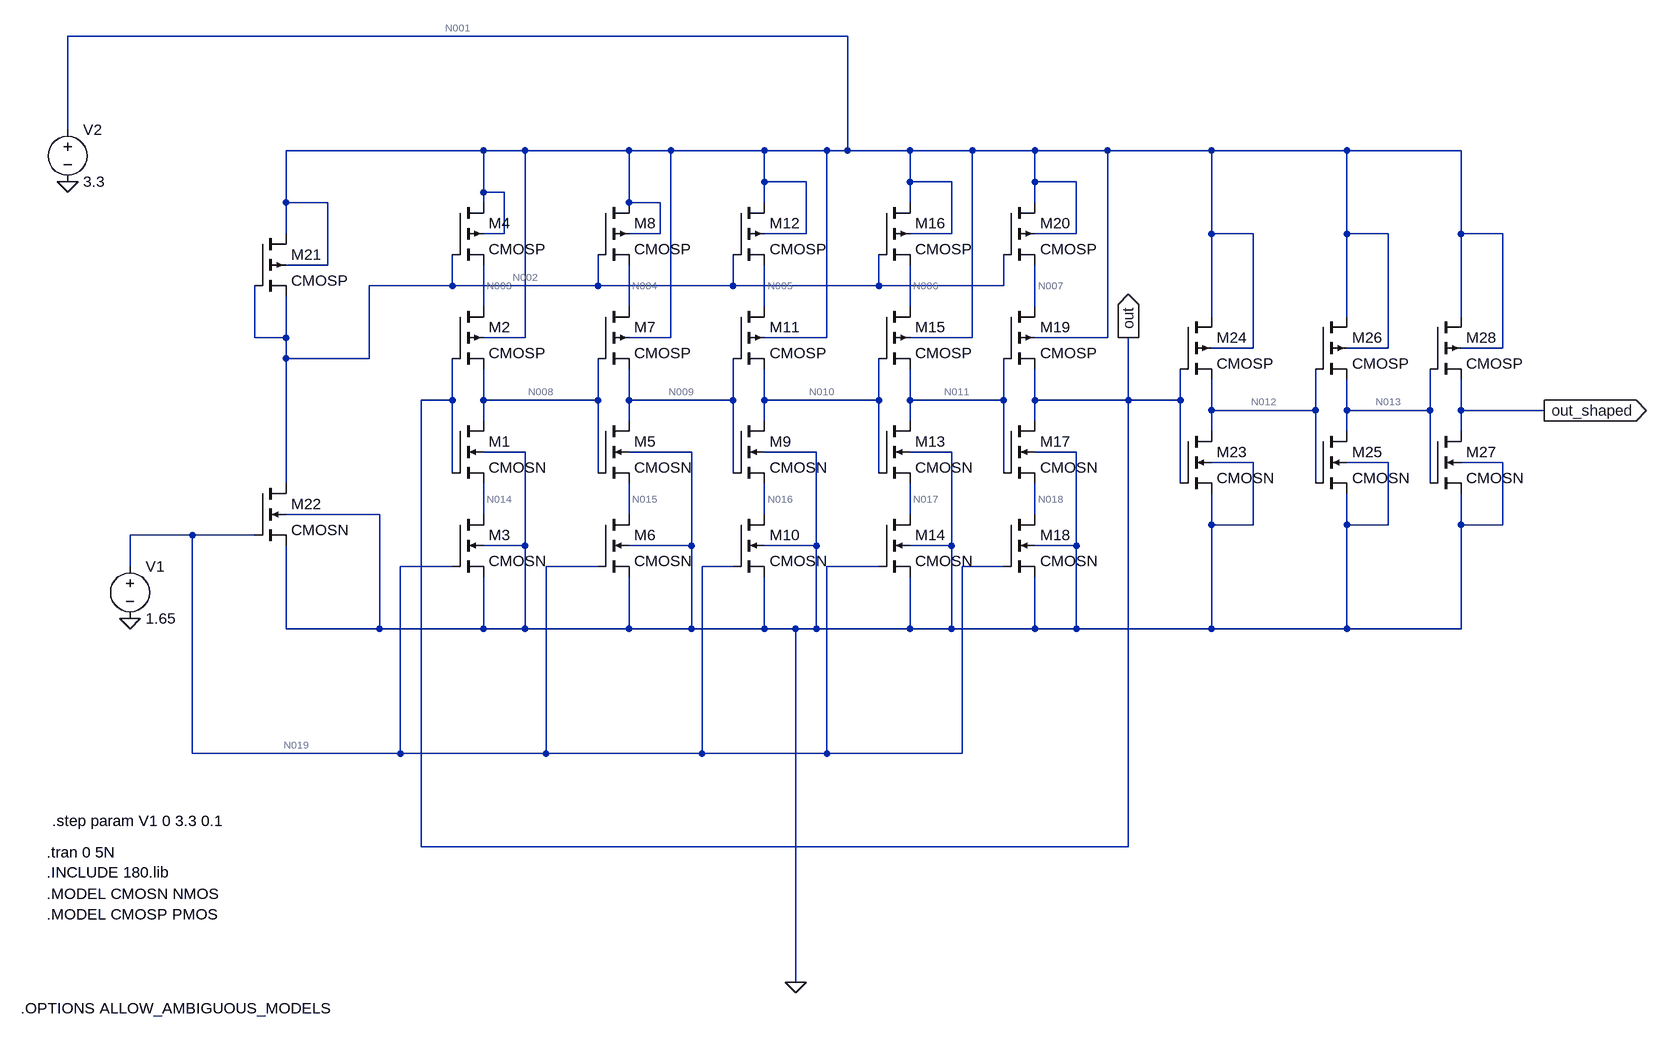
[diagram p0: schematic VCO.asc]
VCO.asc, the LTspice schematic file:
Version 4.1
SHEET 1 2180 1368
WIRE 688 -144 -512 -144
WIRE -512 0 -512 -144
WIRE 128 32 -176 32
WIRE 192 32 128 32
WIRE 352 32 192 32
WIRE 416 32 352 32
WIRE 560 32 416 32
WIRE 656 32 560 32
WIRE 688 32 688 -144
WIRE 688 32 656 32
WIRE 784 32 688 32
WIRE 880 32 784 32
WIRE 976 32 880 32
WIRE 1088 32 976 32
WIRE 1248 32 1088 32
WIRE 1456 32 1248 32
WIRE 1632 32 1456 32
WIRE 560 80 560 32
WIRE 624 80 560 80
WIRE 784 80 784 32
WIRE 848 80 784 80
WIRE 976 80 976 32
WIRE 1040 80 976 80
WIRE 128 96 128 32
WIRE 160 96 128 96
WIRE -176 112 -176 32
WIRE -112 112 -176 112
WIRE 128 112 128 96
WIRE 352 112 352 32
WIRE 400 112 352 112
WIRE 560 112 560 80
WIRE 784 112 784 80
WIRE 976 112 976 80
WIRE -176 160 -176 112
WIRE 160 160 160 96
WIRE 160 160 128 160
WIRE 400 160 400 112
WIRE 400 160 352 160
WIRE 624 160 624 80
WIRE 624 160 560 160
WIRE 848 160 848 80
WIRE 848 160 784 160
WIRE 1040 160 1040 80
WIRE 1040 160 976 160
WIRE 1248 160 1248 32
WIRE 1312 160 1248 160
WIRE 1456 160 1456 32
WIRE 1520 160 1456 160
WIRE 1632 160 1632 32
WIRE 1696 160 1632 160
WIRE -112 208 -112 112
WIRE -112 208 -176 208
WIRE 80 240 80 192
WIRE 80 240 -48 240
WIRE 304 240 304 192
WIRE 304 240 80 240
WIRE 512 240 512 192
WIRE 512 240 304 240
WIRE 736 240 736 192
WIRE 736 240 512 240
WIRE 928 240 928 192
WIRE 928 240 736 240
WIRE 128 272 128 208
WIRE 352 272 352 208
WIRE 560 272 560 208
WIRE 784 272 784 208
WIRE 976 272 976 208
WIRE 1248 288 1248 160
WIRE 1456 288 1456 160
WIRE 1632 288 1632 160
WIRE -224 320 -224 240
WIRE -176 320 -176 256
WIRE -176 320 -224 320
WIRE 192 320 192 32
WIRE 192 320 128 320
WIRE 416 320 416 32
WIRE 416 320 352 320
WIRE 656 320 656 32
WIRE 656 320 560 320
WIRE 880 320 880 32
WIRE 880 320 784 320
WIRE 1088 320 1088 32
WIRE 1088 320 976 320
WIRE 1312 336 1312 160
WIRE 1312 336 1248 336
WIRE 1520 336 1520 160
WIRE 1520 336 1456 336
WIRE 1696 336 1696 160
WIRE 1696 336 1632 336
WIRE -176 352 -176 320
WIRE -48 352 -48 240
WIRE -48 352 -176 352
WIRE 80 416 80 352
WIRE 80 416 32 416
WIRE 128 416 128 368
WIRE 304 416 304 352
WIRE 304 416 128 416
WIRE 352 416 352 368
WIRE 512 416 512 352
WIRE 512 416 352 416
WIRE 560 416 560 368
WIRE 736 416 736 352
WIRE 736 416 560 416
WIRE 784 416 784 368
WIRE 928 416 928 352
WIRE 928 416 784 416
WIRE 976 416 976 368
WIRE 1120 416 1120 320
WIRE 1120 416 976 416
WIRE 1200 416 1200 368
WIRE 1200 416 1120 416
WIRE 1248 432 1248 384
WIRE 1408 432 1408 368
WIRE 1408 432 1248 432
WIRE 1456 432 1456 384
WIRE 1584 432 1584 368
WIRE 1584 432 1456 432
WIRE 1632 432 1632 384
WIRE 1760 432 1632 432
WIRE 128 448 128 416
WIRE 352 448 352 416
WIRE 560 448 560 416
WIRE 784 448 784 416
WIRE 976 448 976 416
WIRE 1248 464 1248 432
WIRE 1456 464 1456 432
WIRE 1632 464 1632 432
WIRE 192 496 128 496
WIRE 448 496 352 496
WIRE 640 496 560 496
WIRE 848 496 784 496
WIRE 1040 496 976 496
WIRE 1312 512 1248 512
WIRE 1520 512 1456 512
WIRE 1696 512 1632 512
WIRE 80 528 80 416
WIRE 304 528 304 416
WIRE 512 528 512 416
WIRE 736 528 736 416
WIRE 928 528 928 416
WIRE -176 544 -176 352
WIRE 1200 544 1200 416
WIRE 1408 544 1408 432
WIRE 1584 544 1584 432
WIRE -32 592 -176 592
WIRE 128 592 128 544
WIRE 352 592 352 544
WIRE 560 592 560 544
WIRE 784 592 784 544
WIRE 976 592 976 544
WIRE 1248 608 1248 560
WIRE 1312 608 1312 512
WIRE 1312 608 1248 608
WIRE 1456 608 1456 560
WIRE 1520 608 1520 512
WIRE 1520 608 1456 608
WIRE 1632 608 1632 560
WIRE 1696 608 1696 512
WIRE 1696 608 1632 608
WIRE -320 624 -416 624
WIRE -224 624 -320 624
WIRE 192 640 192 496
WIRE 192 640 128 640
WIRE 448 640 448 496
WIRE 448 640 352 640
WIRE 640 640 640 496
WIRE 640 640 560 640
WIRE 848 640 848 496
WIRE 848 640 784 640
WIRE 1040 640 1040 496
WIRE 1040 640 976 640
WIRE -416 672 -416 624
WIRE 80 672 0 672
WIRE 304 672 224 672
WIRE 512 672 464 672
WIRE 736 672 656 672
WIRE 928 672 864 672
WIRE -176 768 -176 640
WIRE -32 768 -32 592
WIRE -32 768 -176 768
WIRE 128 768 128 688
WIRE 128 768 -32 768
WIRE 192 768 192 640
WIRE 192 768 128 768
WIRE 352 768 352 688
WIRE 352 768 192 768
WIRE 448 768 448 640
WIRE 448 768 352 768
WIRE 560 768 560 688
WIRE 560 768 448 768
WIRE 608 768 560 768
WIRE 640 768 640 640
WIRE 640 768 608 768
WIRE 784 768 784 688
WIRE 784 768 640 768
WIRE 848 768 848 640
WIRE 848 768 784 768
WIRE 976 768 976 688
WIRE 976 768 848 768
WIRE 1040 768 1040 640
WIRE 1040 768 976 768
WIRE 1248 768 1248 608
WIRE 1248 768 1040 768
WIRE 1456 768 1456 608
WIRE 1456 768 1248 768
WIRE 1632 768 1632 608
WIRE 1632 768 1456 768
WIRE -320 960 -320 624
WIRE 0 960 0 672
WIRE 0 960 -320 960
WIRE 224 960 224 672
WIRE 224 960 0 960
WIRE 464 960 464 672
WIRE 464 960 224 960
WIRE 656 960 656 672
WIRE 656 960 464 960
WIRE 864 960 864 672
WIRE 864 960 656 960
WIRE 32 1104 32 416
WIRE 1120 1104 1120 416
WIRE 1120 1104 32 1104
WIRE 608 1312 608 768
FLAG -416 752 0
FLAG -512 80 0
FLAG 608 1312 0
FLAG 1120 320 out
IOPIN 1120 320 Out
FLAG 1760 432 out_shaped
IOPIN 1760 432 Out
SYMBOL nmos4 80 448 R0
SYMATTR InstName M1
SYMATTR Value2 l=180n w=540n
SYMATTR Value CMOSN
SYMBOL nmos4 80 592 R0
SYMATTR InstName M3
SYMATTR Value2 l=180n w=540n
SYMATTR Value CMOSN
SYMBOL pmos4 80 272 R0
SYMATTR InstName M2
SYMATTR Value2 l=180n w=1350n
SYMATTR Value CMOSP
SYMBOL pmos4 80 112 R0
SYMATTR InstName M4
SYMATTR Value2 l=180n w=1350n
SYMATTR Value CMOSP
SYMBOL nmos4 304 448 R0
SYMATTR InstName M5
SYMATTR Value2 l=180n w=540n
SYMATTR Value CMOSN
SYMBOL nmos4 304 592 R0
SYMATTR InstName M6
SYMATTR Value2 l=180n w=540n
SYMATTR Value CMOSN
SYMBOL pmos4 304 272 R0
SYMATTR InstName M7
SYMATTR Value2 l=180n w=1350n
SYMATTR Value CMOSP
SYMBOL pmos4 304 112 R0
SYMATTR InstName M8
SYMATTR Value2 l=180n w=1350n
SYMATTR Value CMOSP
SYMBOL nmos4 512 448 R0
SYMATTR InstName M9
SYMATTR Value2 l=180n w=540n
SYMATTR Value CMOSN
SYMBOL nmos4 512 592 R0
SYMATTR InstName M10
SYMATTR Value2 l=180n w=540n
SYMATTR Value CMOSN
SYMBOL pmos4 512 272 R0
SYMATTR InstName M11
SYMATTR Value2 l=180n w=1350n
SYMATTR Value CMOSP
SYMBOL pmos4 512 112 R0
SYMATTR InstName M12
SYMATTR Value2 l=180n w=1350n
SYMATTR Value CMOSP
SYMBOL nmos4 736 448 R0
SYMATTR InstName M13
SYMATTR Value2 l=180n w=540n
SYMATTR Value CMOSN
SYMBOL nmos4 736 592 R0
SYMATTR InstName M14
SYMATTR Value2 l=180n w=540n
SYMATTR Value CMOSN
SYMBOL pmos4 736 272 R0
SYMATTR InstName M15
SYMATTR Value2 l=180n w=1350n
SYMATTR Value CMOSP
SYMBOL pmos4 736 112 R0
SYMATTR InstName M16
SYMATTR Value2 l=180n w=1350n
SYMATTR Value CMOSP
SYMBOL nmos4 928 448 R0
SYMATTR InstName M17
SYMATTR Value2 l=180n w=540n
SYMATTR Value CMOSN
SYMBOL nmos4 928 592 R0
SYMATTR InstName M18
SYMATTR Value2 l=180n w=540n
SYMATTR Value CMOSN
SYMBOL pmos4 928 272 R0
SYMATTR InstName M19
SYMATTR Value2 l=180n w=1350n
SYMATTR Value CMOSP
SYMBOL pmos4 928 112 R0
SYMATTR InstName M20
SYMATTR Value2 l=180n w=1350n
SYMATTR Value CMOSP
SYMBOL pmos4 -224 160 R0
SYMATTR InstName M21
SYMATTR Value2 l=180n w=1350n
SYMATTR Value CMOSP
SYMBOL nmos4 -224 544 R0
SYMATTR InstName M22
SYMATTR Value2 l=180n w=540n
SYMATTR Value CMOSN
SYMBOL voltage -416 656 R0
WINDOW 123 0 0 Left 0
WINDOW 39 0 0 Left 0
SYMATTR InstName V1
SYMATTR Value 1.65
SYMBOL nmos4 1200 464 R0
SYMATTR InstName M23
SYMATTR Value2 l=180n w=540n
SYMATTR Value CMOSN
SYMBOL pmos4 1200 288 R0
SYMATTR InstName M24
SYMATTR Value2 l=180n w=1350n
SYMATTR Value CMOSP
SYMBOL nmos4 1408 464 R0
SYMATTR InstName M25
SYMATTR Value2 l=180n w=540n
SYMATTR Value CMOSN
SYMBOL pmos4 1408 288 R0
SYMATTR InstName M26
SYMATTR Value2 l=180n w=1350n
SYMATTR Value CMOSP
SYMBOL nmos4 1584 464 R0
SYMATTR InstName M27
SYMATTR Value2 l=180n w=540n
SYMATTR Value CMOSN
SYMBOL pmos4 1584 288 R0
SYMATTR InstName M28
SYMATTR Value2 l=180n w=1350n
SYMATTR Value CMOSP
SYMBOL voltage -512 -16 R0
WINDOW 123 0 0 Left 0
WINDOW 39 0 0 Left 0
SYMATTR InstName V2
SYMATTR Value 3.3
TEXT -544 1112 Left 2 !.tran 0 5N\n.INCLUDE 180.lib
TEXT -584 1352 Left 2 !.OPTIONS ALLOW_AMBIGUOUS_MODELS
TEXT -544 1176 Left 2 !.MODEL CMOSN NMOS \n.MODEL CMOSP PMOS
TEXT -536 1064 Left 2 !.step param V1 0 3.3 0.1

The netlist it stands for:
* VCO.asc
M1 N008 out N014 0 CMOSN l=180n w=540n
M3 N014 N019 0 0 CMOSN l=180n w=540n
M2 N003 out N008 N001 CMOSP l=180n w=1350n
M4 N001 N002 N003 N001 CMOSP l=180n w=1350n
M5 N009 N008 N015 0 CMOSN l=180n w=540n
M6 N015 N019 0 0 CMOSN l=180n w=540n
M7 N004 N008 N009 N001 CMOSP l=180n w=1350n
M8 N001 N002 N004 N001 CMOSP l=180n w=1350n
M9 N010 N009 N016 0 CMOSN l=180n w=540n
M10 N016 N019 0 0 CMOSN l=180n w=540n
M11 N005 N009 N010 N001 CMOSP l=180n w=1350n
M12 N001 N002 N005 N001 CMOSP l=180n w=1350n
M13 N011 N010 N017 0 CMOSN l=180n w=540n
M14 N017 N019 0 0 CMOSN l=180n w=540n
M15 N006 N010 N011 N001 CMOSP l=180n w=1350n
M16 N001 N002 N006 N001 CMOSP l=180n w=1350n
M17 out N011 N018 0 CMOSN l=180n w=540n
M18 N018 N019 0 0 CMOSN l=180n w=540n
M19 N007 N011 out N001 CMOSP l=180n w=1350n
M20 N001 N002 N007 N001 CMOSP l=180n w=1350n
M21 N001 N002 N002 N001 CMOSP l=180n w=1350n
M22 N002 N019 0 0 CMOSN l=180n w=540n
V1 N019 0 1.65
M23 N012 out 0 0 CMOSN l=180n w=540n
M24 N001 out N012 N001 CMOSP l=180n w=1350n
M25 N013 N012 0 0 CMOSN l=180n w=540n
M26 N001 N012 N013 N001 CMOSP l=180n w=1350n
M27 out_shaped N013 0 0 CMOSN l=180n w=540n
M28 N001 N013 out_shaped N001 CMOSP l=180n w=1350n
V2 N001 0 3.3
.model NMOS NMOS
.model PMOS PMOS
.lib standard.mos
.tran 0 5N
.INCLUDE 180.lib
.OPTIONS ALLOW_AMBIGUOUS_MODELS
.MODEL CMOSN NMOS
.MODEL CMOSP PMOS
.step param V1 0 3.3 0.1
.backanno
.end

* Results of the author's LTspice run, read from the files saved beside the schematic
* Operating Point (first step), zero values left out:
*   V(out) = 1.516 V
*   V(n019) = 1.65 V
*   V(n003) = 2.949 V
*   V(n002) = 1.607 V
*   V(n004) = 2.949 V
*   V(n016) = 228.7 mV
*   V(n005) = 2.949 V
*   V(n017) = 228.7 mV
*   V(n007) = 2.949 V
*   V(n013) = 12.23 mV
*   V(n008) = 1.516 V
*   V(n014) = 228.7 mV
*   V(n001) = 3.3 V
*   V(n009) = 1.516 V
*   V(n015) = 228.7 mV
*   V(n010) = 1.516 V
*   V(n011) = 1.516 V
*   V(n006) = 2.949 V
*   V(n018) = 228.7 mV
*   V(n012) = 2.618 V
*   V(out_shaped) = 3.3 V
*   Id(M26) = 16.59 µA
*   Is(M26) = -16.59 µA
*   Ib(M26) = 3.298 pA
*   Id(M11) = 169.4 µA
*   Is(M11) = -169.4 µA
*   Ib(M11) = 2.156 pA
*   Id(M1) = 169.4 µA
*   Is(M1) = -169.4 µA
*   Ib(M1) = -1.764 pA
*   Id(M6) = 169.4 µA
*   Is(M6) = -169.4 µA
*   Id(M2) = 169.4 µA
*   Is(M2) = -169.4 µA
*   Ib(M2) = 2.156 pA
*   Id(M23) = 277.9 µA
*   Is(M23) = -277.9 µA
*   Ib(M23) = -2.628 pA
*   Id(M14) = 169.4 µA
*   Is(M14) = -169.4 µA
*   Id(M19) = 169.4 µA
*   Is(M19) = -169.4 µA
*   Ib(M19) = 2.156 pA
*   Id(M5) = 169.4 µA
*   Is(M5) = -169.4 µA
*   Ib(M5) = -1.764 pA
*   Id(M13) = 169.4 µA
*   Is(M13) = -169.4 µA
*   Ib(M13) = -1.764 pA
*   Id(M28) = 10 pA
*   Is(M28) = -10 pA
*   Id(M8) = 169.4 µA
*   Is(M8) = -169.4 µA
*   Id(M16) = 169.4 µA
*   Is(M16) = -169.4 µA
*   Id(M21) = 305.9 µA
*   Is(M21) = -305.9 µA
*   Ib(M21) = 1.703 pA
*   Id(M25) = 16.59 µA
*   Is(M25) = -16.59 µA
*   Id(M7) = 169.4 µA
*   Is(M7) = -169.4 µA
*   Ib(M7) = 2.156 pA
*   Id(M27) = 10 pA
*   Is(M27) = -6.692 pA
*   Ib(M27) = -3.31 pA
*   Id(M10) = 169.4 µA
*   Is(M10) = -169.4 µA
*   Id(M15) = 169.4 µA
*   Is(M15) = -169.4 µA
*   Ib(M15) = 2.156 pA
*   Id(M18) = 169.4 µA
*   Is(M18) = -169.4 µA
*   Id(M20) = 169.4 µA
*   Is(M20) = -169.4 µA
*   Id(M3) = 169.4 µA
*   Is(M3) = -169.4 µA
*   Id(M12) = 169.4 µA
*   Is(M12) = -169.4 µA
*   Id(M4) = 169.4 µA
*   Is(M4) = -169.4 µA
*   Id(M17) = 169.4 µA
*   Is(M17) = -169.4 µA
*   Ib(M17) = -1.764 pA
*   Id(M24) = 277.9 µA
*   Is(M24) = -277.9 µA
*   I(V2) = -1.447 mA
*   Id(M9) = 169.4 µA
*   Is(M9) = -169.4 µA
*   Ib(M9) = -1.764 pA
*   Id(M22) = 305.9 µA
*   Is(M22) = -305.9 µA
*   Ib(M22) = -1.617 pA